# EAGLE schematic grip_force (EAGLE 9.0.0)
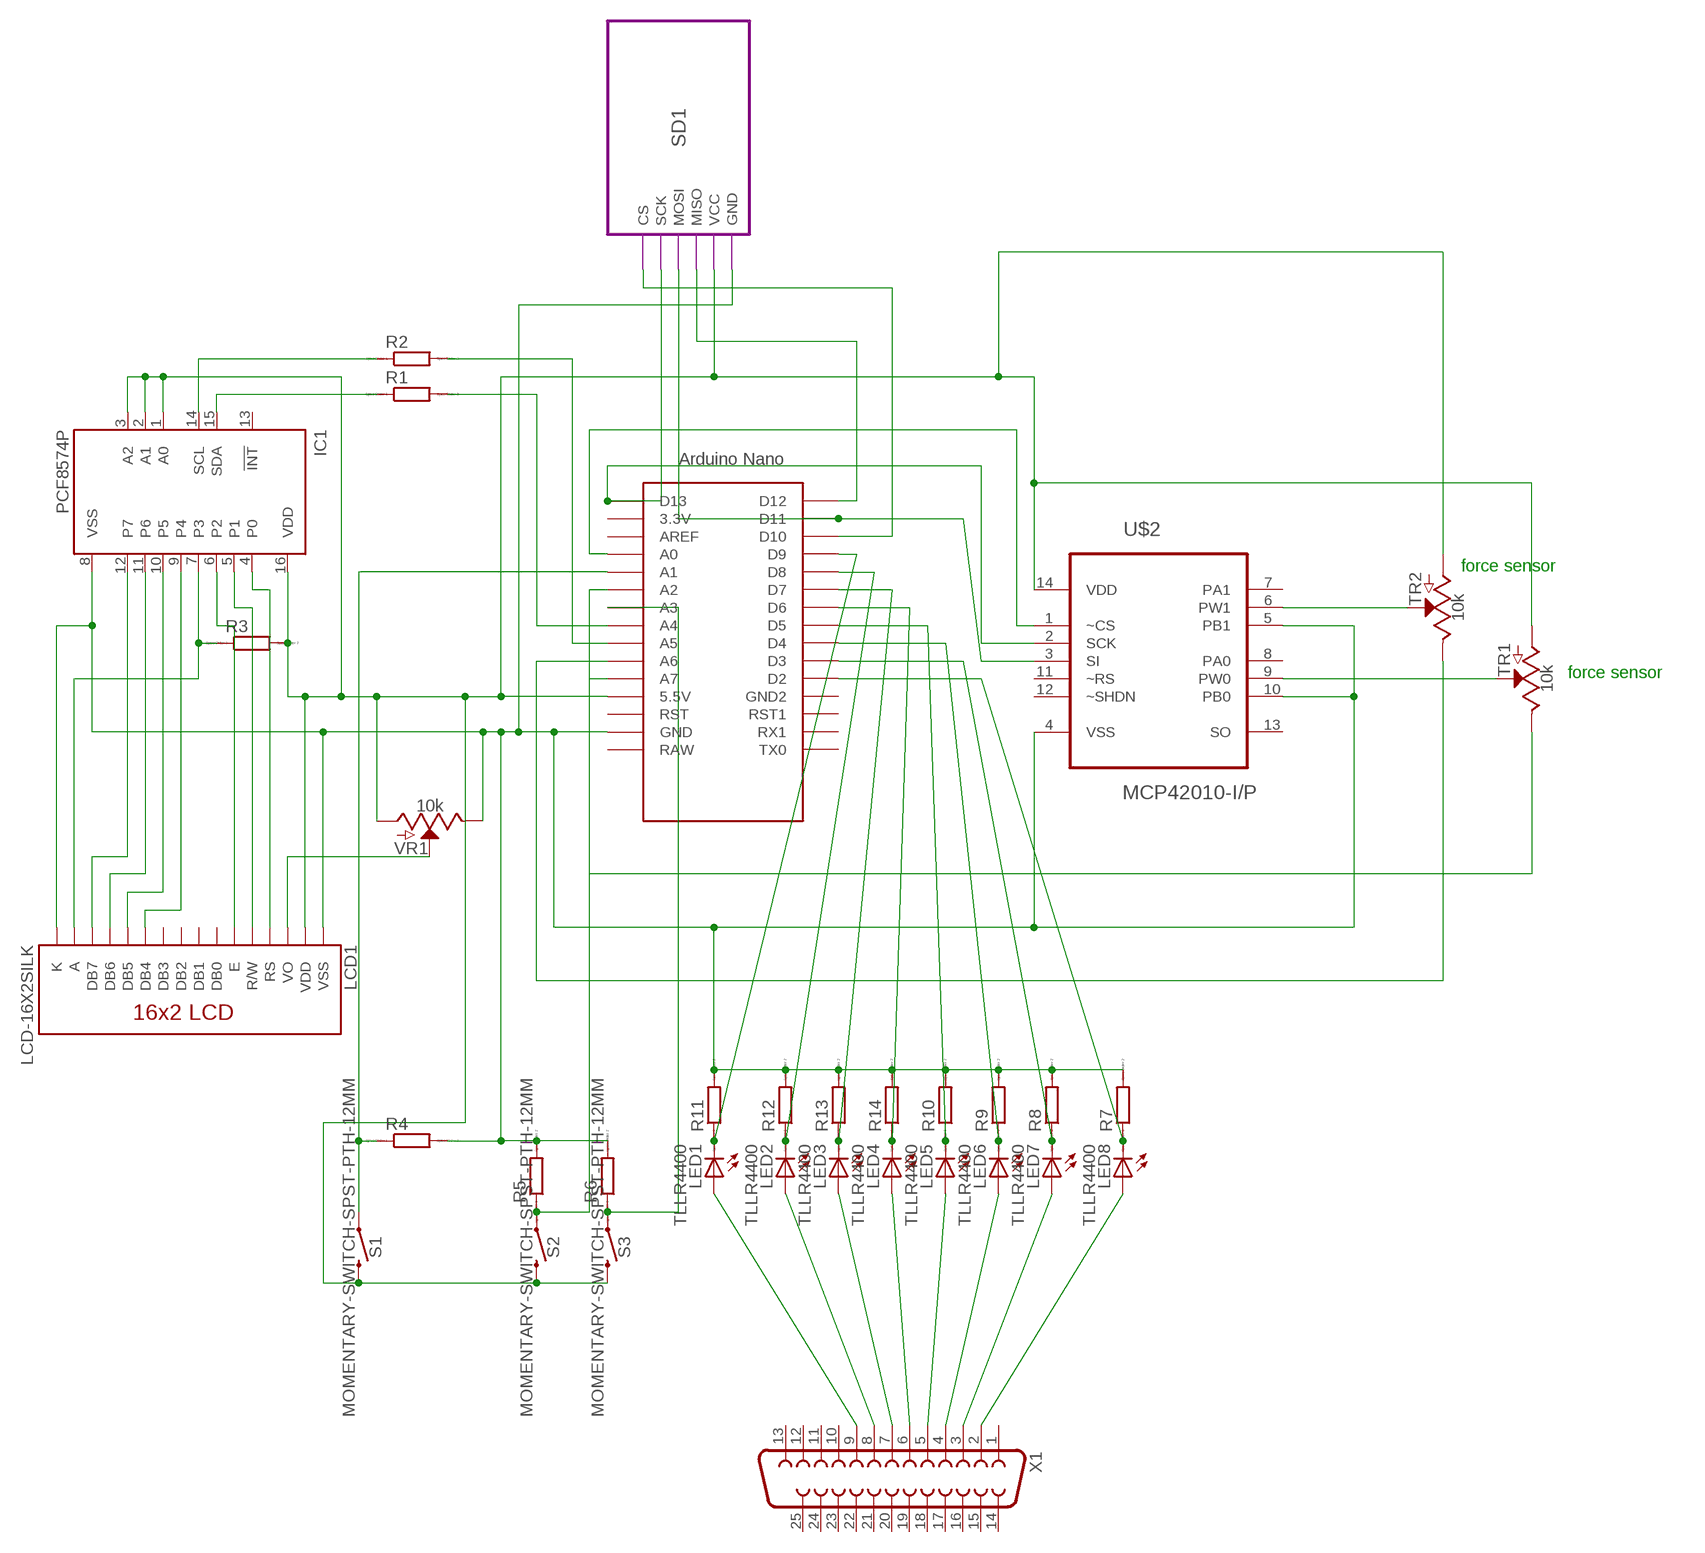
[diagram p0: schematic, sheet 1]

## Parts
IC1  PCF8574P  [DIL16]
LCD1  LCD-16X2SILK  [LCD-16X2]
LED1  TLLR4400  [LED3MM]
LED2  TLLR4400  [LED3MM]
LED3  TLLR4400  [LED3MM]
LED4  TLLR4400  [LED3MM]
LED5  TLLR4400  [LED3MM]
LED6  TLLR4400  [LED3MM]
LED7  TLLR4400  [LED3MM]
LED8  TLLR4400  [LED3MM]
R1  R0207/10  [0207/10]
R2  R0207/10  [0207/10]
R3  R0207/10  [0207/10]
R4  R0207/10  [0207/10]
R5  R0207/10  [0207/10]
R6  R0207/10  [0207/10]
R7  R0207/10  [0207/10]
R8  R0207/10  [0207/10]
R9  R0207/10  [0207/10]
R10  R0207/10  [0207/10]
R11  R0207/10  [0207/10]
R12  R0207/10  [0207/10]
R13  R0207/10  [0207/10]
R14  R0207/10  [0207/10]
S1  MOMENTARY-SWITCH-SPST-PTH-12MM  [TACTILE_SWITCH_PTH_12MM]
S2  MOMENTARY-SWITCH-SPST-PTH-12MM  [TACTILE_SWITCH_PTH_12MM]
S3  MOMENTARY-SWITCH-SPST-PTH-12MM  [TACTILE_SWITCH_PTH_12MM]
TR1  10k  POTENTIOMETER-PTH-9MM-1/20W-20%-KIT  [POT-PTH-ALPS-KIT]
TR2  10k  POTENTIOMETER-PTH-9MM-1/20W-20%-KIT  [POT-PTH-ALPS-KIT]
U$1  NANO  [NANO]
U$2  MCP42010-I/P  [DIP254P762X432-14]
VR1  10k  POTENTIOMETER-PTH-9MM-1/20W-20%-KIT  [POT-PTH-ALPS-KIT]
X1  F25VP  [F25VP]

## Module instances
SD1 = SD

## Nets
N$1: IC1.7(P3) LCD1.15(A) R3.1
N$2: R1.2 U$1.A4
N$3: R2.2 U$1.A5
N$4: U$1.D11 U$2.3(SI) ; port SD1.MOSI
N$5: U$1.A0 U$2.1(~CS)
N$6: U$1.D13 U$2.2(SCK) ; port SD1.SCK
N$7: U$1.D12 ; port SD1.MISO
N$8: TR1.P$1(E) U$1.A7
N$9: LCD1.3(VO) VR1.P$2(S)
N$10: LED1.A X1.9
N$11: LED2.K(C) R12.1 U$1.D8
N$12: LED3.K(C) R13.1 U$1.D7
N$13: LED4.K(C) R14.1 U$1.D6
N$14: LED5.K(C) R10.1 U$1.D5
N$15: LED6.K(C) R9.1 U$1.D4
N$16: LED7.K(C) R8.1 U$1.D3
N$17: LED8.K(C) R7.1 U$1.D2
N$18: IC1.15(SDA) R1.1
N$19: IC1.14(SCL) R2.1
N$20: TR1.P$2(S) U$2.9(PW0)
N$21: TR2.P$2(S) U$2.6(PW1)
N$22: TR2.P$1(E) U$1.A6
N$23: IC1.4(P0) LCD1.4(RS)
N$24: IC1.5(P1) LCD1.5(R/W)
N$25: IC1.6(P2) LCD1.6(E)
N$26: IC1.9(P4) LCD1.11(DB4)
N$27: IC1.10(P5) LCD1.12(DB5)
N$28: IC1.11(P6) LCD1.13(DB6)
N$29: IC1.12(P7) LCD1.14(DB7)
N$30: LED1.K(C) R11.1 U$1.D9
N$31: U$1.D10 ; port SD1.CS
N$32: IC1.1(A0) IC1.2(A1) IC1.3(A2) IC1.16(VDD) LCD1.2(VDD) R3.2 S1.3 S2.3 S3.3 TR1.P$3(A) TR2.P$3(A) U$1.5V(5.5V) U$2.14(VDD) VR1.P$3(A) ; port SD1.VCC
N$33: R5.1 S2.1 U$1.A2
N$34: R4.1 S1.1 U$1.A1
N$36: R6.1 S3.1 U$1.A3
N$37: LED2.A X1.8
N$38: LED3.A X1.7
N$39: LED4.A X1.6
N$40: LED5.A X1.5
N$41: LED6.A X1.4
N$42: LED7.A X1.3
N$43: LED8.A X1.2
N$44: IC1.8(VSS) LCD1.1(VSS) LCD1.16(K) R4.2 R5.2 R6.2 R7.2 R8.2 R9.2 R10.2 R11.2 R12.2 R13.2 R14.2 U$1.GND U$2.4(VSS) U$2.5(PB1) U$2.10(PB0) VR1.P$1(E) ; port SD1.GND
Unconnected: IC1.13(!INT) LCD1.7(DB0) LCD1.8(DB1) LCD1.9(DB2) LCD1.10(DB3) U$1.3.3V U$1.AREF U$1.GND1(GND2) U$1.ICSP1 U$1.ICSP2 U$1.ICSP3 U$1.ICSP4 U$1.ICSP5 U$1.ICSP6 U$1.RAW U$1.RST U$1.RST1 U$1.RX1 U$1.TX0 U$2.7(PA1) U$2.8(PA0) U$2.11(~RS) U$2.12(~SHDN) U$2.13(SO) X1.1 X1.10 X1.11 X1.12 X1.13 X1.14 X1.15 X1.16 X1.17 X1.18 X1.19 X1.20 X1.21 X1.22 X1.23 X1.24 X1.25

## Notes on the sheet
- force sensor
- force sensor

## Library data of the parts
IC1 = micro-philips:PCF8574: I2C-Bus Remote 8-bit I/O expander http://www.semiconductors.philips.com/acrobat_download/datasheets/PCF8574_4.pdf; MPN: PCF8574PN; OC_FARNELL: 204020; OC_NEWARK: 11N8515
LCD1 = SparkFun-Displays:LCD-16X2: Standard text-only 16x2 parallel input LCD Basic 16 character by 2 line display. Typically utilizes the extremely common HD44780 parallel interface chipset SparkFun Products: Basic 16x2 Green <https://www.sparkfun.com/products/255> Basic 8x2 Green <https://www.sparkfun.com/products/11122>; SF_ID: LCD-00255
LED1-LED8 = led:TLLR4400: Low Current (2mA) LED 3 mm Tinted Diffused Package color RED Source: Data sheet <http://www.farnell.com/datasheets/391100.pdf>; MF: VISHAY SEMICONDUCTOR; OC_FARNELL: 1612437
R1-R14 = eagle-ltspice:R: RESISTOR, European symbol; SPICEMODEL: NONE; SPICEPREFIX: R
S1-S3 = SparkFun-Switches:MOMENTARY-SWITCH-SPST: Momentary Switch (Pushbutton) - SPST Normally-open (NO) SPST momentary switches (buttons, pushbuttons). Variants PTH-12MM - 12mm square, through-hole Momentary Pushbutton Switch - 12mm Square <https://www.sparkfun.com/products/9190> (COM-09190) PTH-6.0MM, PTH-6.0MM-KIT - 6.0mm square, through-hole Mini Pushbutton Switch <https://www.sparkfun.com/products/97> (COM-00097) KIT package intended for soldering kit's - only one side of pads' copper is exposed. PTH-RIGHT-ANGLE-KIT - Right-angle, through-hole Right Angle Tactile Button <https://www.sparkfun.com/products/10791> - Used on SparkFun BigTime Watch Kit <https://www.sparkfun.com/products/11734> SMD-12MM - 12mm square, surface-mount Tactile Button - SMD (12mm) <https://www.sparkfun.com/products/12993> (COM-12993) Used on SparkFun PicoBoard <https://www.sparkfun.com/products/11888> SMD-4.5MM - 4.5mm Square Trackball Switch Used on SparkFun Blackberry Trackballer Breakout <https://www.sparkfun.com/products/13169> SMD-4.6MMX2.8MM - 4.60mm x 2.80mm, surface mount Used on SparkFun SAMD21 Mini Breakout <https://www.sparkfun.com/products/13664> SMD-5.2MM, SMD-5.2-REDUNDANT - 5.2mm square, surface-mount Mini Pushbutton Switch - SMD <https://www.sparkfun.com/products/8720> (COM-08720) Used on Arduino Pro Mini <https://www.sparkfun.com/products/11114> REDUNDANT package connects both switch circuits together SMD-6.0X3.5MM - 6.0 x 3.5mm, surface mount Momentary Reset Switch SMD <https://www.sparkfun.com/products/8229> (COM-08229) SMD-6.2MM-TALL - 6.2mm square, surface mount Tactile Button - SMD (6mm) <https://www.sparkfun.com/products/12992> Used on SparkFun Digital Sandbox <https://www.sparkfun.com/products/12651> SMD-RIGHT-ANGLE - Right-angle, surface mount Used on SparkFun Block for Intel® Edison - Arduino <https://www.sparkfun.com/products/13036>; PROD_ID: SWCH-09185; SF_SKU: COM-09190
TR1 TR2 VR1 = SparkFun-Resistors:POTENTIOMETER: Potentiometer (Pot) Three-terminal potentiometers, with an adjustable wiper and two adjustable resistors. A pot can be used to create a configurable voltage divider, or as a variable resistor. Variants ALPS_POT and ALPS_POT_KIT - PTH, breadboard compatible, 9mm square pots Rotary Potentiometer - Linear (10k ohm) <https://www.sparkfun.com/products/9288> (COM-09288) The KIT variant exposes copper on only one side of the PTH pad, so the part can only be assembled on one side of the PCB. Useful for beginner soldering kits.; PROD_ID: RES-09177; SF_SKU: COM-09288
U$1 = Arduino-clone:NANO: Arduino Nano
U$2 = MCP42010-I_P:MCP42010-I/P: Digital Potentiometer; MPN: MCP42010-I/P; OC_FARNELL: 9758615; OC_NEWARK: 24C6511; PACKAGE: DIP-14; SUPPLIER: Microchip
X1 = con-subd:F25: SUB-D; OC_FARNELL: unknown; OC_NEWARK: unknown

## Module SD
Ports: CS(io) SCK(io) MOSI(io) MISO(io) VCC(io) GND(io)

### Library data of the parts